# EasyEDA schematic SCH_RE2-AY-3-8910-v0.3_2024-09-28.json

## Sheets
1 PSG: TITLE: Sheet_1; REV: 1.0; Date: 2023-12-22; Sheet: 1/1; Drawn By: Denjhang; Company: Your Company
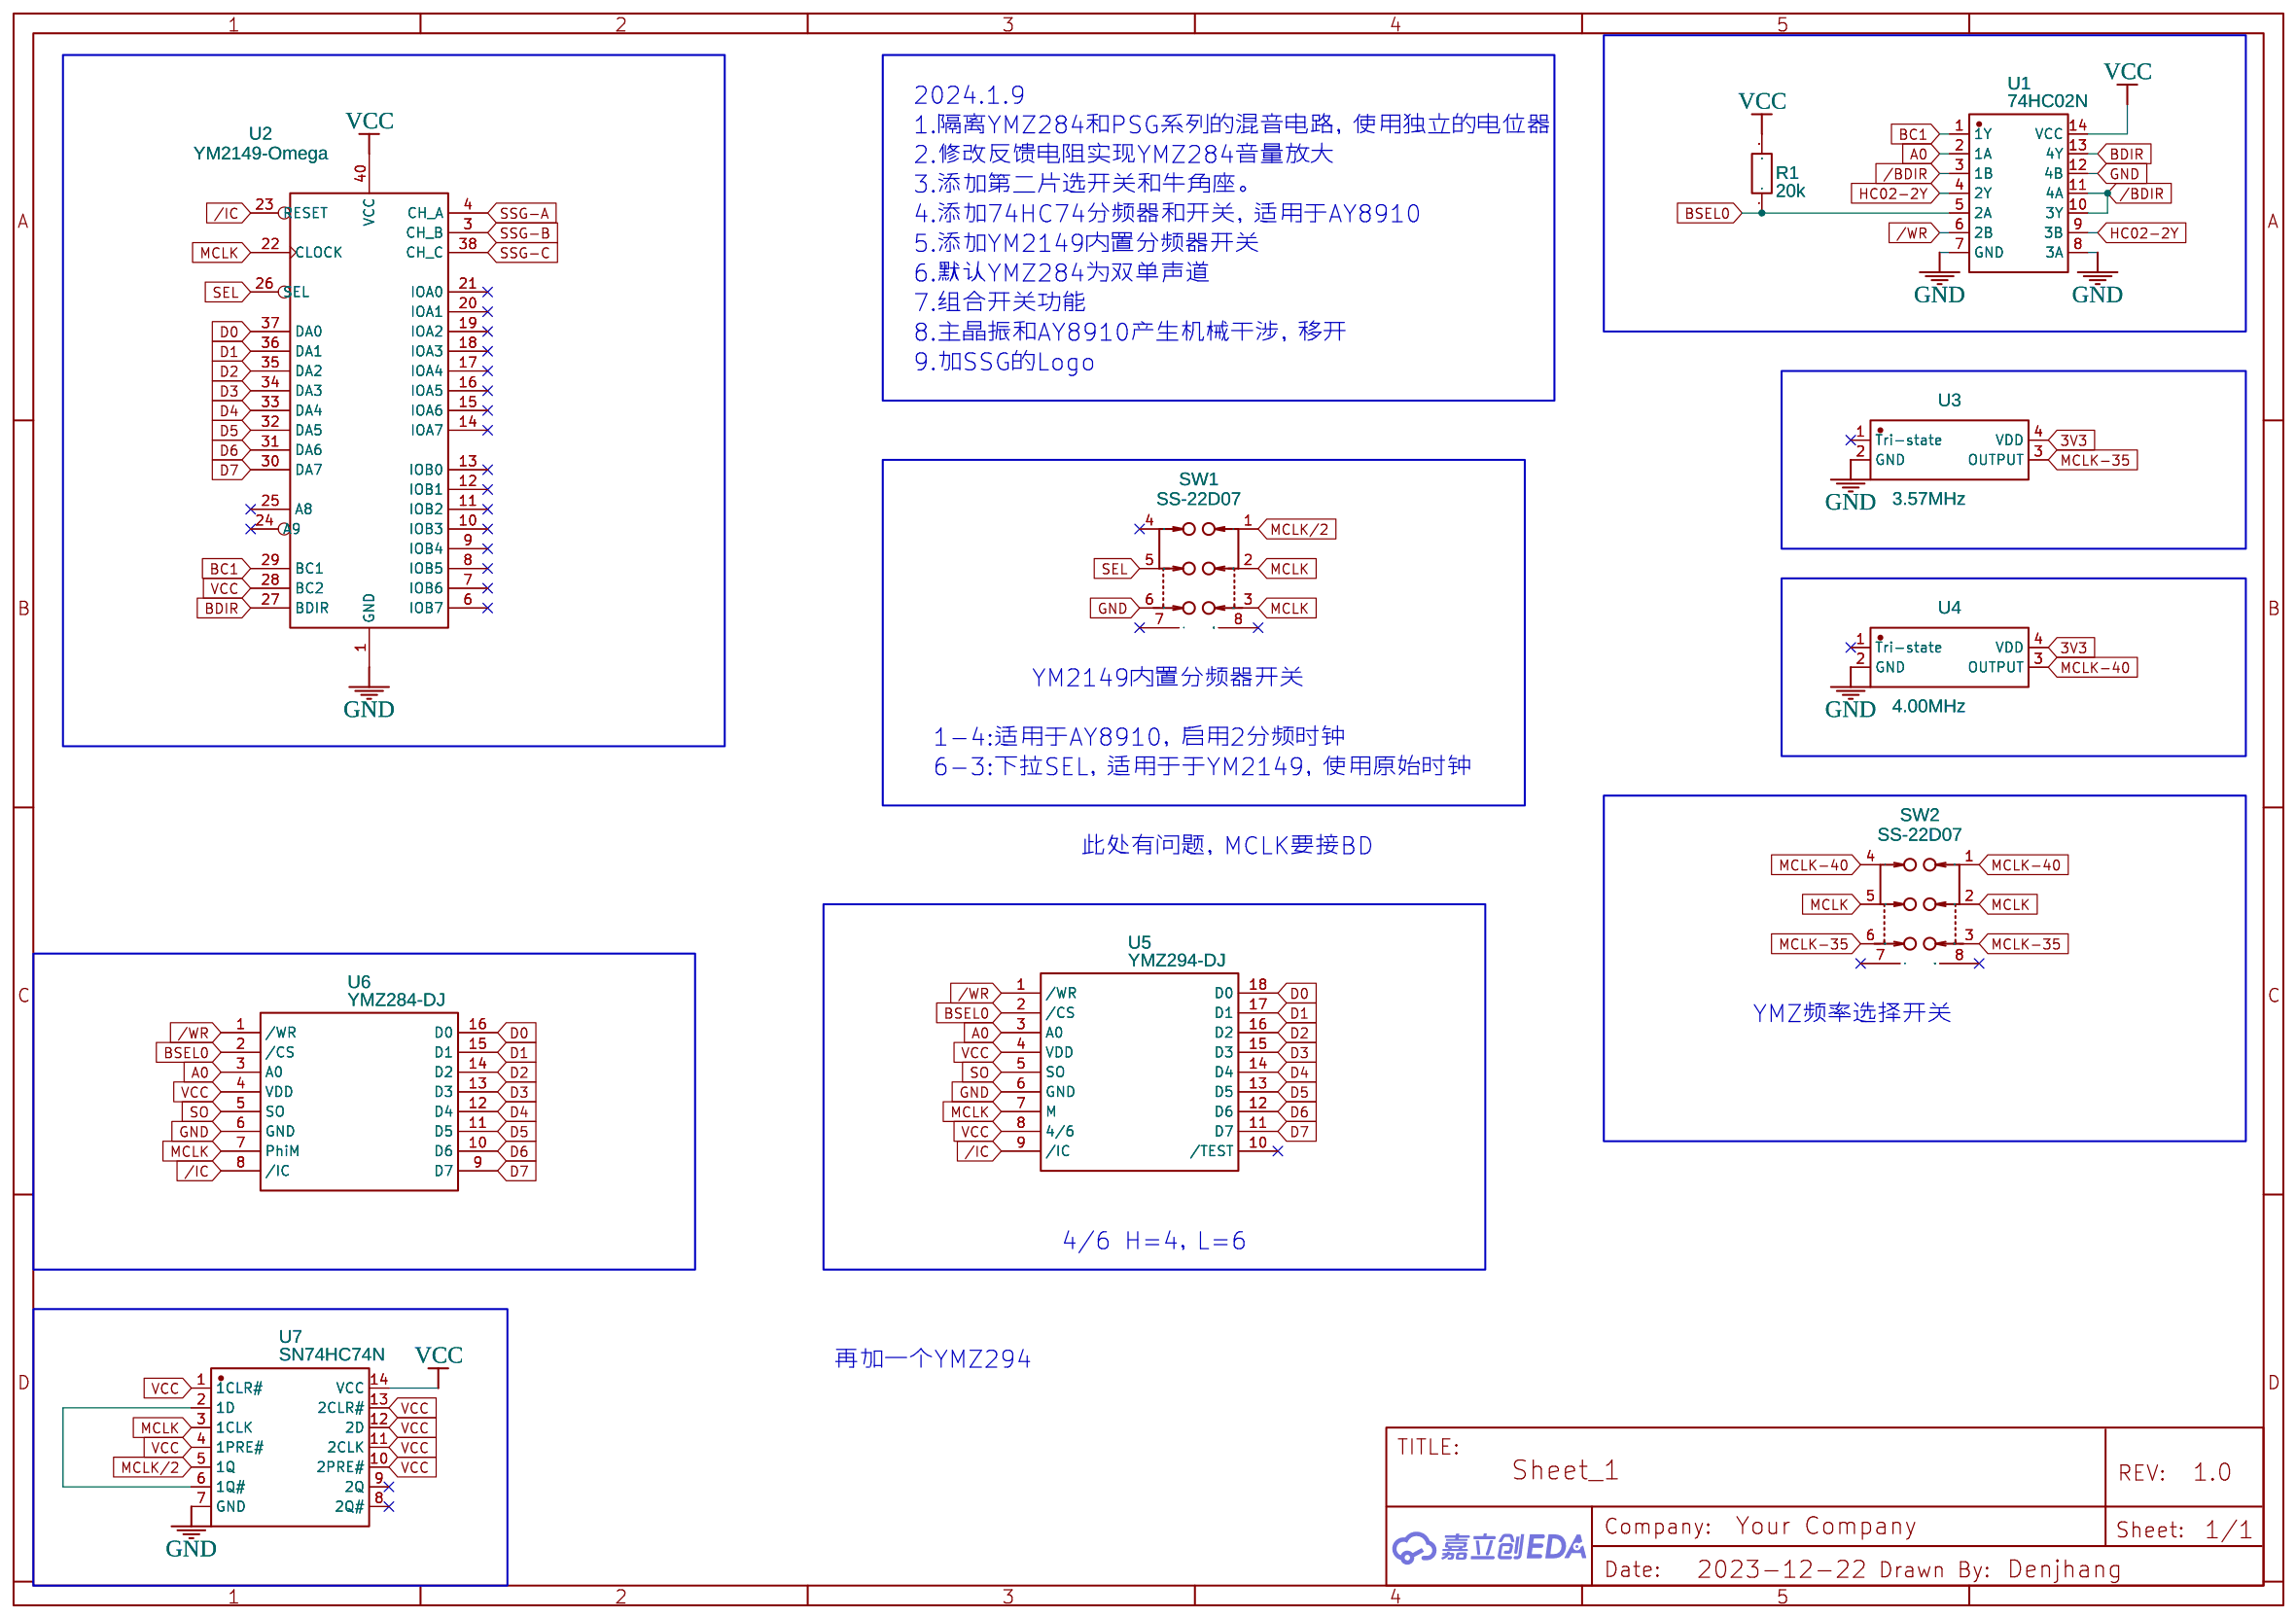
[diagram p0: PSG]
2 Stereo: Date: 2023-12-23
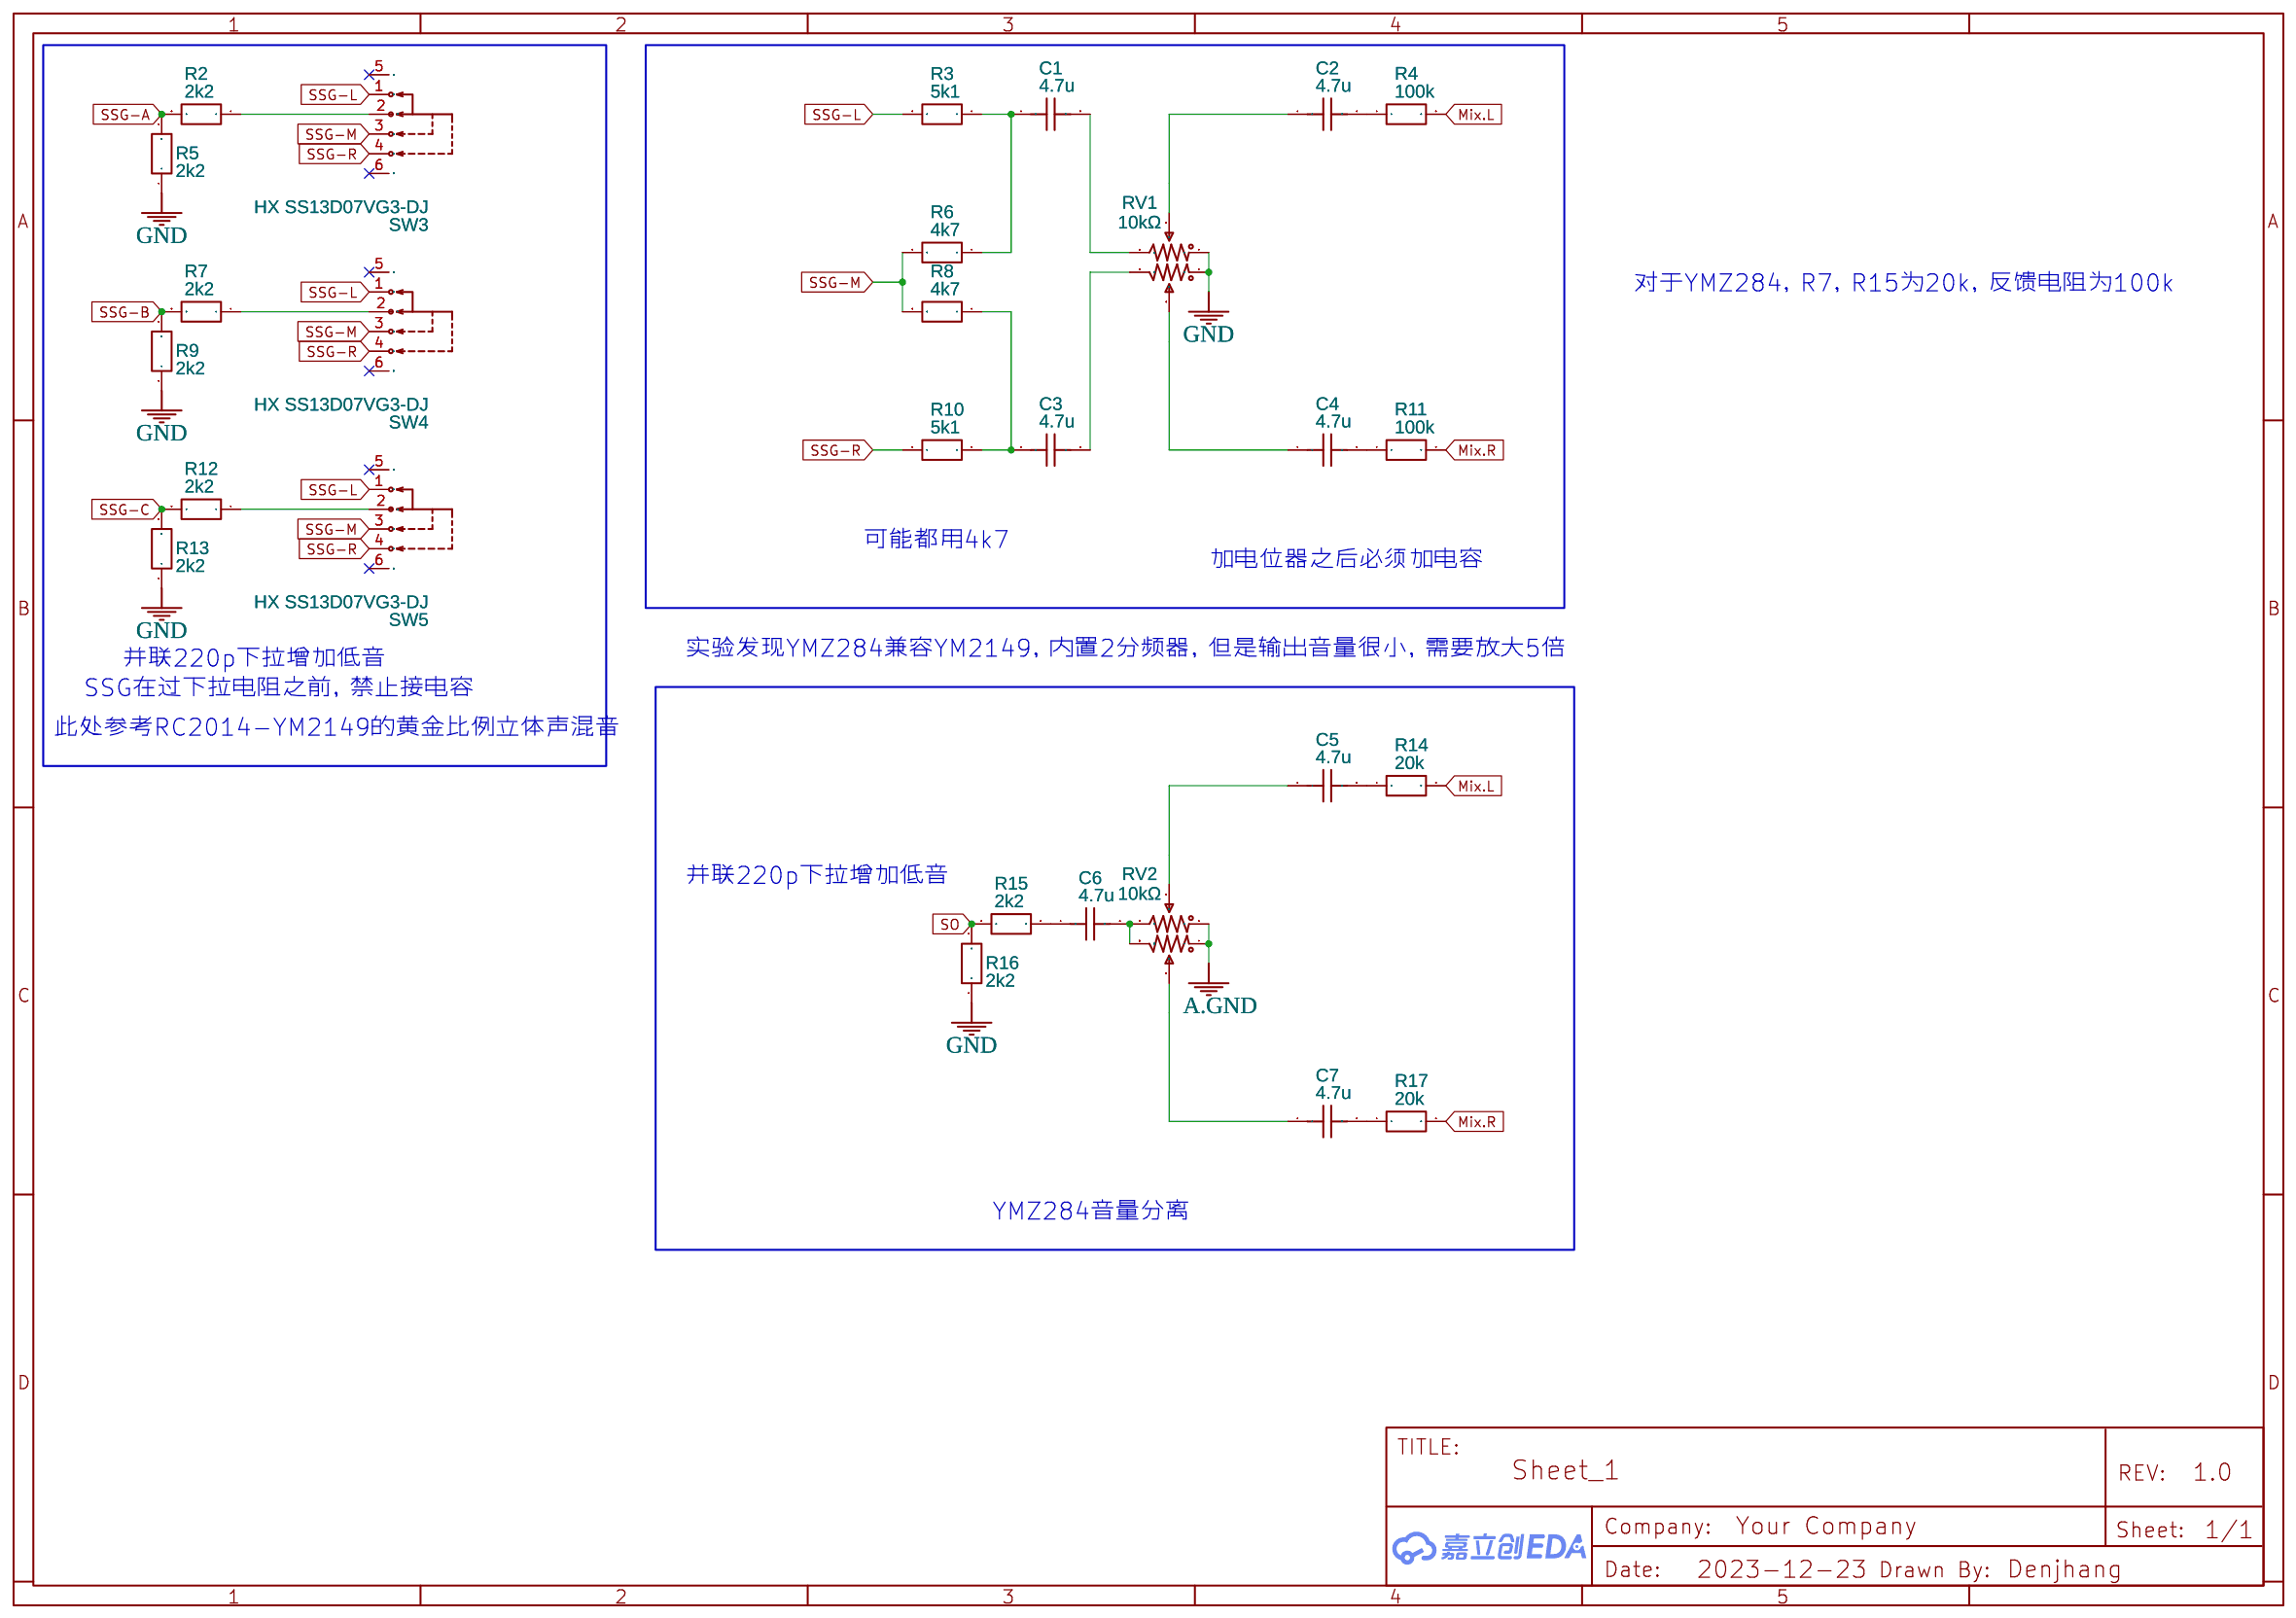
[diagram p1: Stereo]
3 Mixer: Date: 2023-12-23
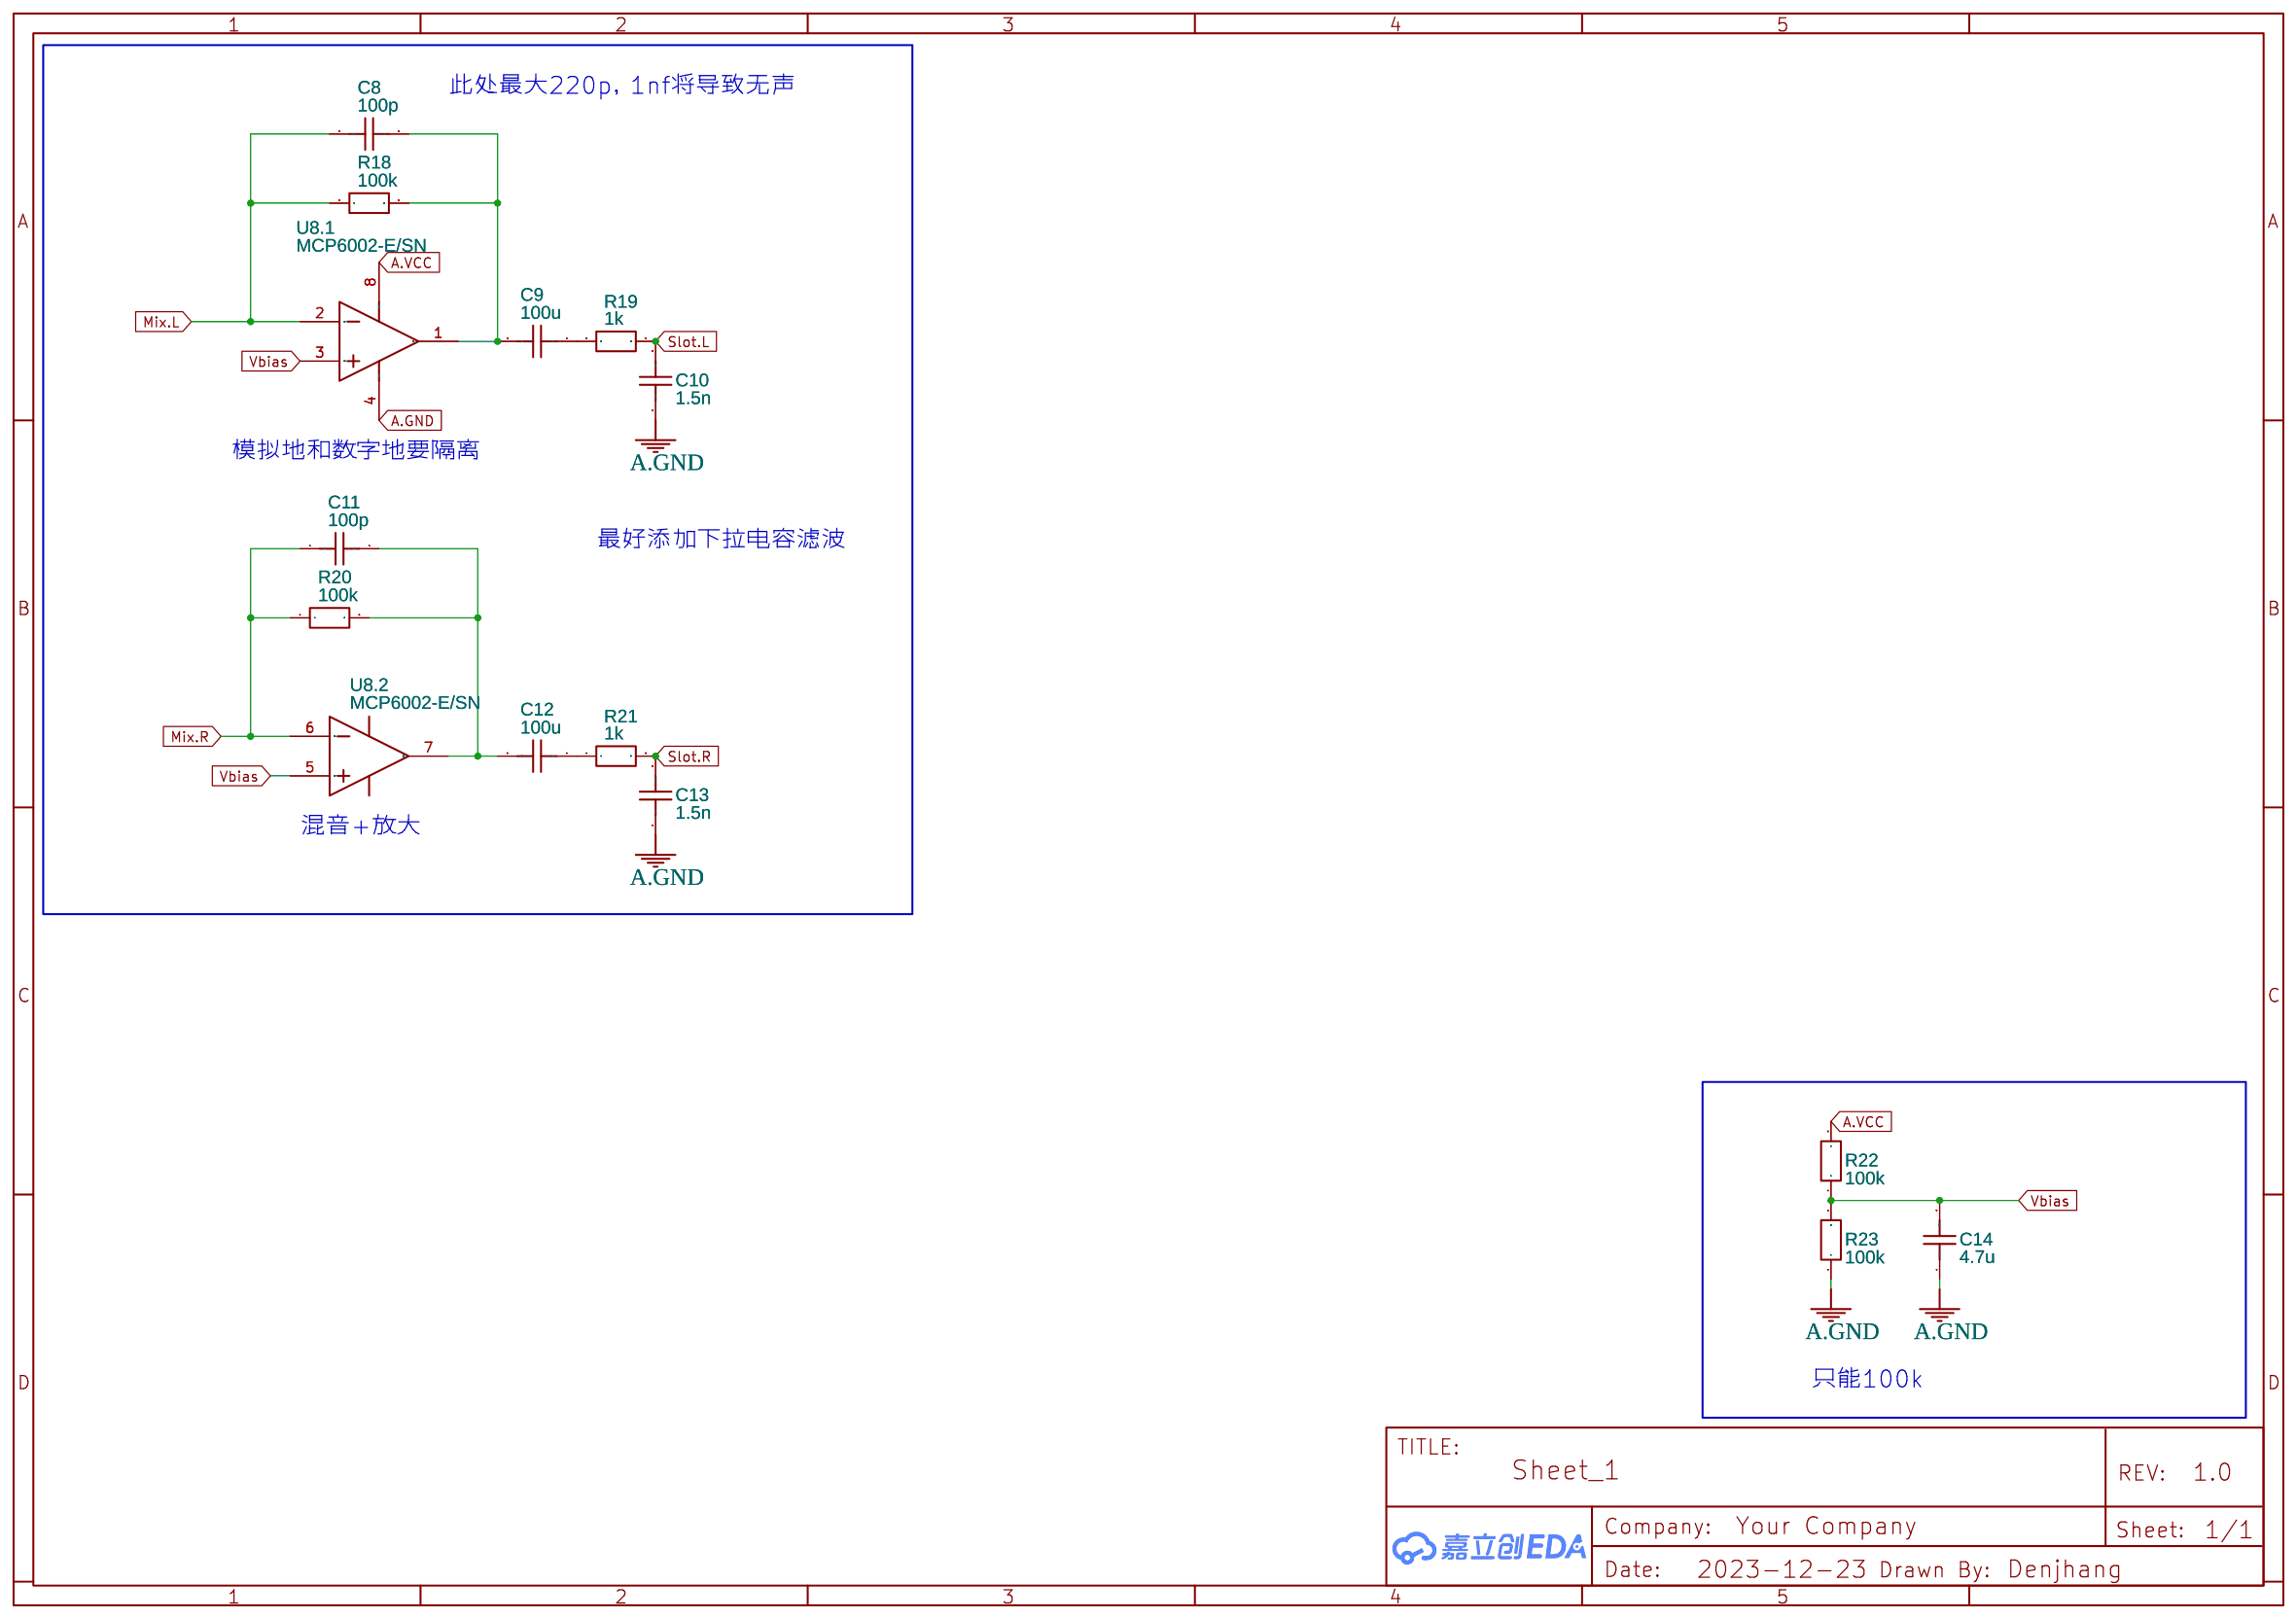
[diagram p2: Mixer]
4 BUS: Date: 2023-12-23
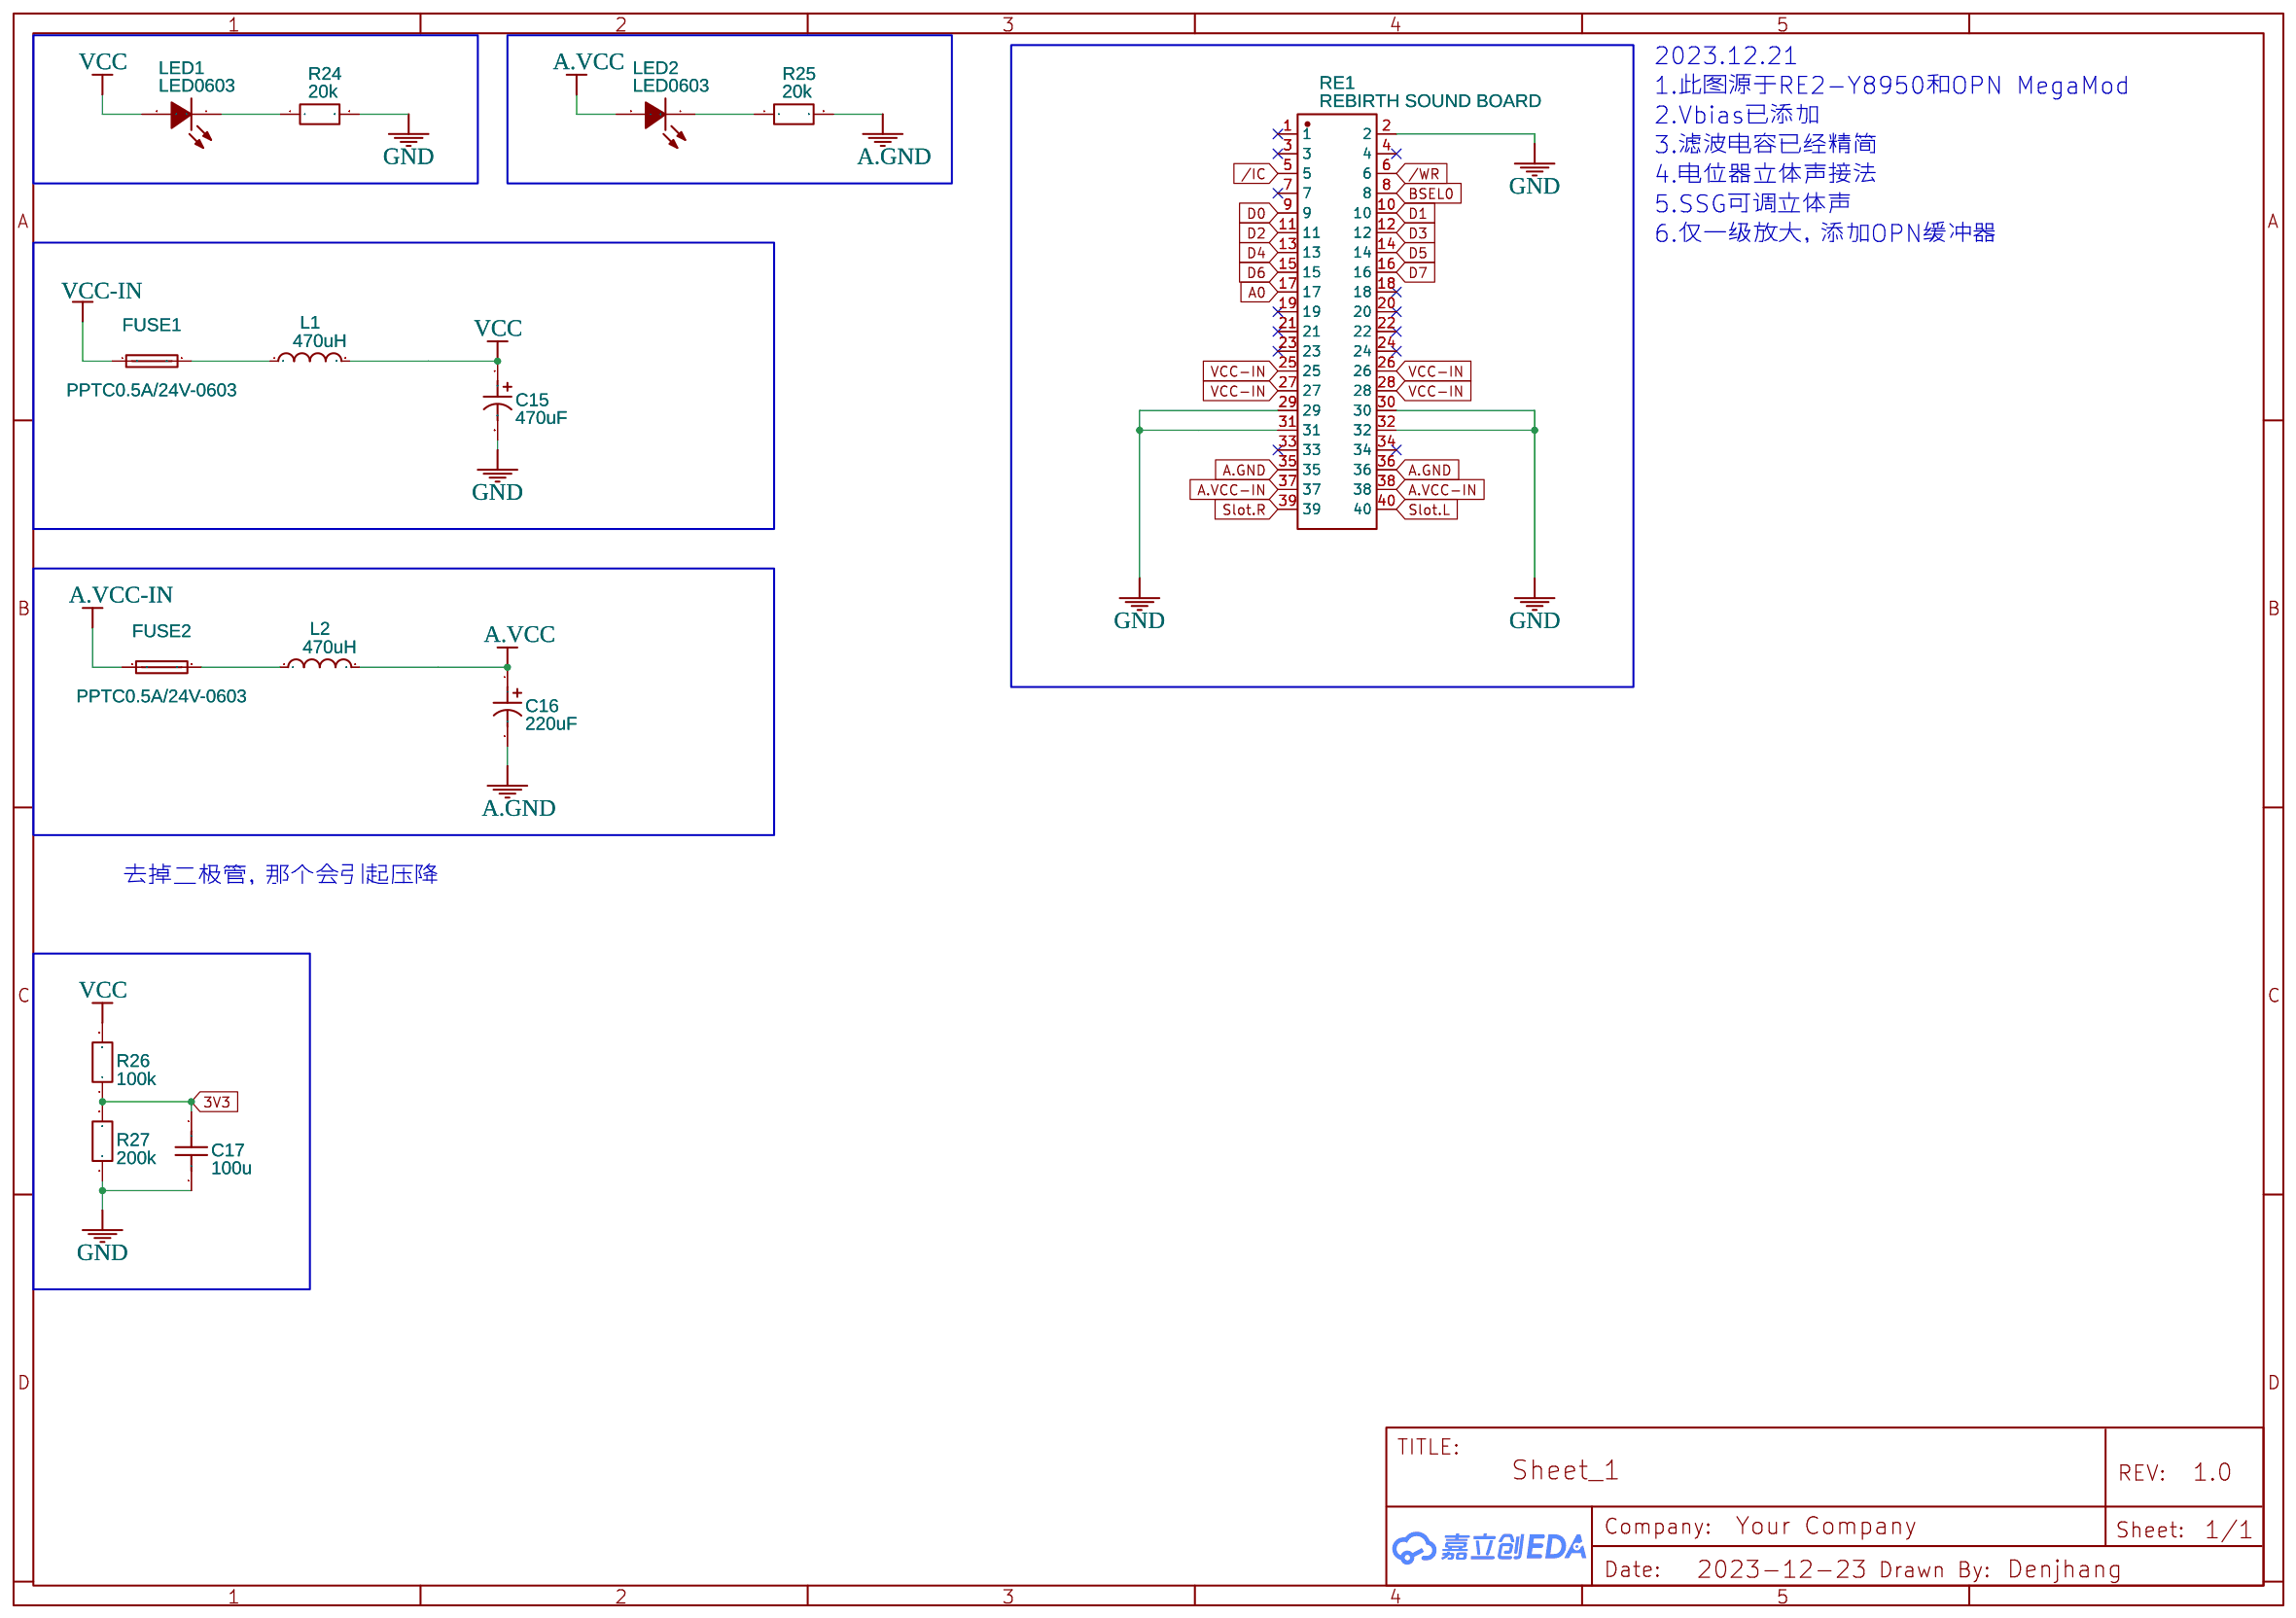
[diagram p3: BUS]

## Parts
sheet BUS
C15  470uF  [CAP-SMD_BD6.3-L6.6-W6.6-FD]
C16  220uF  [CAP-SMD_BD6.3-L6.6-W6.6-LS7.2-FD]
C17  100u  [C1206]
FUSE1  PPTC0.5A/24V-0603  [F0603]
FUSE2  PPTC0.5A/24V-0603  [F0603]
L1  470uH  [IND-SMD_L5.8-W5.2]
L2  470uH  [IND-SMD_L5.8-W5.2]
LED1  LED0603  [LED0603-RD]
LED2  LED0603  [LED0603-RD]
R24  20k  [R0603]
R25  20k  [R0603]
R26  100k  [R0603]
R27  200k  [R0603]
RE1  REBIRTH SOUND BOARD  [REBIRTH SOUND BOARD]
sheet Mixer
C8  100p  [C0603]
C9  100u  [C1206]
C10  1.5n  [C0603]
C11  100p  [C0603]
C12  100u  [C1206]
C13  1.5n  [C0603]
C14  4.7u  [C0603]
R18  100k  [R0603]
R19  1k  [R0603]
R20  100k  [R0603]
R21  1k  [R0603]
R22  100k  [R0603]
R23  100k  [R0603]
U8  MCP6002-E/SN  [SOIC-8_L5.0-W4.0-P1.27-LS6.0-BL]  (sections 1,2)
sheet PSG
R1  20k  [R0603]
SW1  SS-22D07  [SW-TH_SS-22D07]
SW2  SS-22D07  [SW-TH_SS-22D07]
U1  74HC02N  [DIP-14_L19.6-W6.4-P2.54-LS7.6-BL]
U2  YM2149-Omega  [DIP40-DJ]
U3  3.57MHz  [OSC-SMD_4P-L3.2-W2.5-BL]
U4  4.00MHz  [OSC-SMD_4P-L3.2-W2.5-BL]
U5  YMZ294-DJ  [DIP-18_方孔IC插座]
U6  YMZ284-DJ  [DIP16-DJ]
U7  SN74HC74N  [PDIP-14_L19.3-W6.4-P2.54-LS7.6-BL]
sheet Stereo
C1  4.7u  [C0603]
C2  4.7u  [C0603]
C3  4.7u  [C0603]
C4  4.7u  [C0603]
C5  4.7u  [C0603]
C6  4.7u  [C0603]
C7  4.7u  [C0603]
R2  2k2  [R0603]
R3  5k1  [R0603]
R4  100k  [R0603]
R5  2k2  [R0603]
R6  4k7  [R0603]
R7  2k2  [R0603]
R8  4k7  [R0603]
R9  2k2  [R0603]
R10  5k1  [R0603]
R11  100k  [R0603]
R12  2k2  [R0603]
R13  2k2  [R0603]
R14  20k  [R0603]
R15  2k2  [R0603]
R16  2k2  [R0603]
R17  20k  [R0603]
RV1  10kΩ  [RK097G-DJ]
RV2  10kΩ  [RK097G-DJ]
SW3  HX SS13D07VG3-DJ  [SW-TH_SS13D07VG4]
SW4  HX SS13D07VG3-DJ  [SW-TH_SS13D07VG4]
SW5  HX SS13D07VG3-DJ  [SW-TH_SS13D07VG4]

## Library data of the parts
C15 = RVT220UF16V67RV0015: Contributor: LCSC; Supplier: LCSC; Supplier Part: C2887273; Manufacturer: KNSCHA(科尼盛); JLCPCB Part Class: Extended Part; link: https://so.szlcsc.com/global.html?k=C2887273&ref=editor
C16 = RVT47UF35V67RV0039: Contributor: LCSC; Supplier: LCSC; Supplier Part: C2836440; Manufacturer: KNSCHA(科尼盛); JLCPCB Part Class: Extended Part; link: https://so.szlcsc.com/global.html?k=C2836440&ref=editor
C9 C12 C17 = C_1206_US: Contributor: LCEDA_Lib
FUSE1 FUSE2 = PPTC0.5A/24V-0603: Contributor: LCSC; Supplier: LCSC; Supplier Part: C9900007586; Manufacturer: null; Manufacturer Part: PPTC0.5A/24V 自恢复保险丝-0603; JLCPCB Part Class: Extended Part
L1 L2 = MSCD54-471KT: Contributor: LCSC; Supplier: LCSC; Supplier Part: C915206; Manufacturer: Meled(美莱); JLCPCB Part Class: Extended Part; link: https://so.szlcsc.com/global.html?k=C915206&ref=editor
LED1 LED2 = LED0603: Supplier: LCSC; Supplier Part: C2892154; Manufacturer: GBG; Manufacturer Part: GBG-C192KRKT; link: https://atta.szlcsc.comnull; Contributor: Denjhang
R1-R27 = R_0603_EU: Contributor: LCEDA_Lib
RE1 = REBIRTH SOUND BOARD: Contributor: lcsc; Supplier: LCSC; Supplier Part: C5242133; Manufacturer: XKB Connectivity(中国星坤); Manufacturer Part: X6522WR-2x20H-C60D30-E43F03
C1-C8 C10 C11 C13 C14 = C_0603_US: Contributor: LCEDA_Lib
U8 = MCP6002-E/SN: subpart_no: 1; Supplier: LCSC; Supplier Part: C636235; Manufacturer: MICROCHIP(美国微芯); JLCPCB Part Class: Extended Part
SW1 SW2 = SS-22D07: Supplier Part: C34982; Supplier: LCSC; Manufacturer: ReliaPro; JLCPCB Part Class: Extended Part; link: https://so.szlcsc.com/global.html?k=C34982&ref=editor
U1 = 74HC02N: Contributor: LCSC; Supplier: LCSC; Supplier Part: C507193; Manufacturer: HGSEMI(华冠); link: https://so.szlcsc.com/global.html?k=C507193&ref=editor
U2 = YM2149-Omega: Contributor: denjhang
U3 U4 = OT32254MJBA4SL: Contributor: lcsc; Supplier: LCSC; Supplier Part: C2831397; Manufacturer: YXC(扬兴晶振); JLCPCB Part Class: Extended Part; link: https://so.szlcsc.com/global.html?k=C2831397&ref=editor
U5 = YMZ294-DJ: Contributor: denjhang
U6 = YMZ284-DJ: Contributor: Denjhang
U7 = SN74HC74N: JLCPCB Part Class: Extended Part; Supplier: LCSC; Manufacturer: TI(德州仪器); Supplier Part: C2895; link: https://so.szlcsc.com/global.html?k=C2895&ref=editor
RV1 RV2 = RK097-双连体: Contributor: LCSC; Supplier: LCSC; Supplier Part: C231763; Manufacturer: ALPSALPINE(阿尔卑斯阿尔派); Manufacturer Part: RK09712200MY; JLCPCB Part Class: Extended Part
SW3-SW5 = HX SS13D07VG3-DJ: Supplier: LCSC; Supplier Part: C5149830; Manufacturer: hanxia(韩下); Manufacturer Part: HX SS13D07VG3; link: https://atta.szlcsc.com/upload/public/pdf/source/20220907/D3055C4464BFAA66BEB4549CABC5DD1D.pdf; Contributor: Denjhang

## Nets
3V3: C17.2 R26.1 R27.2 U3.4(VDD) U4.4(VDD)
GND: C15.2 C17.1 R5.1 R9.1 R13.1 R16.1 R24.2 R27.1 RE1.2 RE1.29 RE1.30 RE1.31 RE1.32 RV1.1 RV1.4 SW1.6 U1.7(GND) U1.8(3A) U1.12(4B) U2.1(GND) U3.2(GND) U4.2(GND) U5.6(GND) U6.6(GND) U7.7(GND)
VCC: C15.1 L1.2 LED1.2(A) R1.2 R26.2 U1.14(VCC) U2.28(BC2) U2.40(VCC) U5.4(VDD) U5.8(4/6) U6.4(VDD) U7.1(1CLR#) U7.4(1PRE#) U7.10(2PRE#) U7.11(2CLK) U7.12(2D) U7.13(2CLR#) U7.14(VCC)
VCC-IN: FUSE1.1 RE1.25 RE1.26 RE1.27 RE1.28
/BDIR: U1.3(1B) U1.10(3Y) U1.11(4A)
/IC: RE1.5 U2.23(RESET) U5.9(/IC) U6.8(/IC)
/WR: RE1.6 U1.6(2B) U5.1(/WR) U6.1(/WR)
A0: RE1.17 U1.2(1A) U5.3(A0) U6.3(A0)
A.GND: C10.1 C13.1 C14.1 C16.2 R23.1 R25.2 RE1.35 RE1.36 RV2.1 RV2.4 U8.4(VSS)
A.VCC: C16.1 L2.2 LED2.2(A) R22.2 U8.8(VDD)
A.VCC-IN: FUSE2.1 RE1.37 RE1.38
BC1: U1.1(1Y) U2.29(BC1)
BDIR: U1.13(4Y) U2.27(BDIR)
BSEL0: R1.1 RE1.8 U1.5(2A) U5.2(/CS) U6.2(/CS)
D0: RE1.9 U2.37(DA0) U5.18(D0) U6.16(D0)
D1: RE1.10 U2.36(DA1) U5.17(D1) U6.15(D1)
D2: RE1.11 U2.35(DA2) U5.16(D2) U6.14(D2)
D3: RE1.12 U2.34(DA3) U5.15(D3) U6.13(D3)
D4: RE1.13 U2.33(DA4) U5.14(D4) U6.12(D4)
D5: RE1.14 U2.32(DA5) U5.13(D5) U6.11(D5)
D6: RE1.15 U2.31(DA6) U5.12(D6) U6.10(D6)
D7: RE1.16 U2.30(DA7) U5.11(D7) U6.9(D7)
HC02-2Y: U1.4(2Y) U1.9(3B)
MCLK: SW1.2 SW1.3 SW2.2 SW2.5 U2.22(CLOCK) U5.7(M) U6.7(PhiM) U7.3(1CLK)
MCLK-35: SW2.3 SW2.6 U3.3(OUTPUT)
MCLK-40: SW2.1 SW2.4 U4.3(OUTPUT)
MCLK/2: SW1.1 U7.5(1Q)
Mix.L: C8.1 R4.2 R14.2 R18.1 U8.2(VINA-)
Mix.R: C11.1 R11.2 R17.2 R20.1 U8.6(VINB-)
SEL: SW1.5 U2.26(SEL)
Slot.L: C10.2 R19.2 RE1.40
Slot.R: C13.2 R21.2 RE1.39
SO: R15.2 R16.2 U5.5(SO) U6.5(SO)
SSG-A: R2.2 R5.2 U2.4(CH_A)
SSG-B: R7.2 R9.2 U2.3(CH_B)
SSG-C: R12.2 R13.2 U2.38(CH_C)
SSG-L: R3.2 SW3.1 SW4.1 SW5.1
SSG-M: R6.2 R8.2 SW3.3 SW4.3 SW5.3
SSG-R: R10.2 SW3.4 SW4.4 SW5.4
Vbias: C14.2 R22.1 R23.2 U8.3(VINA+) U8.5(VINB+)
Net-(C1-1): C1.1 R3.1 R6.1
Net-(C1-2): C1.2 RV1.3
Net-(C2-1): C2.1 RV1.2
Net-(C2-2): C2.2 R4.1
Net-(C3-1): C3.1 R8.1 R10.1
Net-(C3-2): C3.2 RV1.6
Net-(C4-1): C4.1 RV1.5
Net-(C4-2): C4.2 R11.1
Net-(C5-1): C5.1 RV2.2
Net-(C5-2): C5.2 R14.1
Net-(C6-1): C6.1 R15.1
Net-(C6-2): C6.2 RV2.3 RV2.6
Net-(C7-1): C7.1 RV2.5
Net-(C7-2): C7.2 R17.1
Net-(C8-2): C8.2 C9.2 R18.2 U8.1(VOUTA)
Net-(C9-1): C9.1 R19.1
Net-(C11-2): C11.2 C12.2 R20.2 U8.7(VOUTB)
Net-(C12-1): C12.1 R21.1
Net-(FUSE1-2): FUSE1.2 L1.1
Net-(FUSE2-2): FUSE2.2 L2.1
Net-(LED1-1): LED1.1(C) R24.1
Net-(LED2-1): LED2.1(C) R25.1
Net-(R2-1): R2.1 SW3.2
Net-(R7-1): R7.1 SW4.2
Net-(R12-1): R12.1 SW5.2
Net-(U7-2): U7.2(1D) U7.6(1Q#)

Not connected (* = marked no-connect by the designer): RE1 1* 3* 4* 7* 18* 19* 20* 21* 22* 23* 24* 33* 34*; SW1 4* 7* 8*; SW2 7* 8*; SW3 5* 6*; SW4 5* 6*; SW5 5* 6*; U2 6(IOB7)* 7(IOB6)* 8(IOB5)* 9(IOB4)* 10(IOB3)* 11(IOB2)* 12(IOB1)* 13(IOB0)* 14(IOA7)* 15(IOA6)* 16(IOA5)* 17(IOA4)* 18(IOA3)* 19(IOA2)* 20(IOA1)* 21(IOA0)* 24(A9)* 25(A8)*; U3 1(Tri-state)*; U4 1(Tri-state)*; U5 10(/TEST)*; U7 8(2Q#)* 9(2Q)*

## Notes on the sheets
sheet 1
- 2024.1.9
- 1.隔离YMZ284和PSG系列的混音电路，使用独立的电位器
- 2.修改反馈电阻实现YMZ284音量放大
- 3.添加第二片选开关和牛角座。
- 4.添加74HC74分频器和开关，适用于AY8910
- 5.添加YM2149内置分频器开关
- 6.默认YMZ284为双单声道
- 7.组合开关功能
- 8.主晶振和AY8910产生机械干涉，移开
- 9.加SSG的Logo
- YM2149内置分频器开关
- 1-4:适用于AY8910，启用2分频时钟
- 6-3:下拉SEL，适用于于YM2149，使用原始时钟
- 此处有问题，MCLK要接BD
- YMZ频率选择开关
- 4/6 H=4，L=6
- 再加一个YMZ294
sheet 2
- 对于YMZ284，R7，R15为20k，反馈电阻为100k
- 可能都用4k7
- 加电位器之后必须加电容
- 并联220p下拉增加低音
- 实验发现YMZ284兼容YM2149，内置2分频器，但是输出音量很小，需要放大5倍
- SSG在过下拉电阻之前，禁止接电容
- 此处参考RC2014-YM2149的黄金比例立体声混音
- 并联220p下拉增加低音
- YMZ284音量分离
sheet 3
- 此处最大220p，1nf将导致无声
- 模拟地和数字地要隔离
- 最好添加下拉电容滤波
- 混音+放大
- 只能100k
sheet 4
- 2023.12.21
- 1.此图源于RE2-Y8950和OPN MegaMod
- 2.Vbias已添加
- 3.滤波电容已经精简
- 4.电位器立体声接法
- 5.SSG可调立体声
- 6.仅一级放大，添加OPN缓冲器
- 去掉二极管，那个会引起压降
